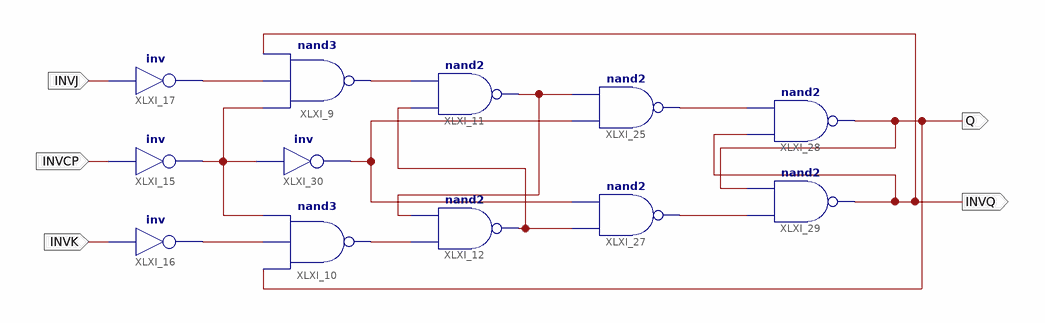
[diagram p0: schematic sheet 1]
// Xilinx ISE schematic myjk.sch (spartan3e) as structural Verilog: 12 symbols, 5 ports
module myjk (
  input  INVJ,
  input  INVCP,
  input  INVK,
  output INVQ,
  output Q
);

  wire XLXN_11, XLXN_15, XLXN_27, XLXN_42, XLXN_43, XLXN_46, XLXN_50, XLXN_51;

  nand XLXI_9 (XLXN_11, INVQ, XLXN_42, XLXN_27);
  nand XLXI_10 (XLXN_15, XLXN_27, XLXN_43, Q);
  nand XLXI_11 (Q, XLXN_11, INVQ);
  nand XLXI_12 (INVQ, Q, XLXN_15);
  not XLXI_15 (XLXN_27, INVCP);
  not XLXI_16 (XLXN_43, INVK);
  not XLXI_17 (XLXN_42, INVJ);
  nand XLXI_25 (XLXN_50, Q, XLXN_46);
  nand XLXI_27 (XLXN_51, XLXN_46, INVQ);
  nand XLXI_28 (Q, XLXN_50, INVQ);
  nand XLXI_29 (INVQ, Q, XLXN_51);
  not XLXI_30 (XLXN_46, XLXN_27);
endmodule
